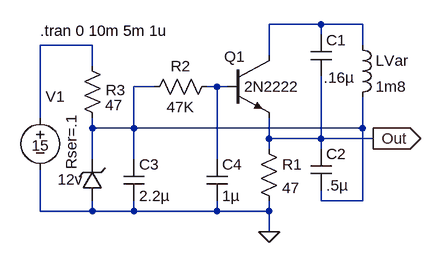
[diagram p0: schematic Colpitts.asc]
Colpitts.asc, the LTspice schematic file:
Version 4
SHEET 1 880 680
WIRE 144 112 64 112
WIRE 208 112 144 112
WIRE 144 128 144 112
WIRE -208 144 -288 144
WIRE 208 144 208 112
WIRE 64 160 64 112
WIRE -208 176 -208 144
WIRE -112 208 -144 208
WIRE -16 208 -32 208
WIRE 0 208 -16 208
WIRE -288 256 -288 144
WIRE -208 272 -208 256
WIRE -144 272 -144 208
WIRE -144 272 -208 272
WIRE 208 272 208 224
WIRE 208 272 -144 272
WIRE 64 288 64 256
WIRE 144 288 144 192
WIRE 144 288 64 288
WIRE 224 288 144 288
WIRE 64 304 64 288
WIRE 144 304 144 288
WIRE -208 320 -208 272
WIRE -144 320 -144 272
WIRE -16 320 -16 208
WIRE 144 384 144 368
WIRE 208 384 208 272
WIRE 208 384 144 384
WIRE -288 400 -288 336
WIRE -208 400 -208 384
WIRE -208 400 -288 400
WIRE -144 400 -144 384
WIRE -144 400 -208 400
WIRE -16 400 -16 384
WIRE -16 400 -144 400
WIRE 64 400 64 384
WIRE 64 400 -16 400
WIRE 64 432 64 400
FLAG 64 432 0
FLAG 224 288 Out
IOPIN 224 288 Out
SYMBOL npn2 0 160 R0
WINDOW 0 -5 2 Left 0
WINDOW 3 26 48 Left 0
SYMATTR InstName Q1
SYMATTR Value 2N2222
SYMBOL ind 192 128 R0
SYMATTR InstName LVar
SYMATTR Value 1m8
SYMBOL cap 128 128 R0
WINDOW 3 20 66 Left 0
SYMATTR Value .16µ
SYMATTR InstName C1
SYMBOL cap 128 304 R0
SYMATTR InstName C2
SYMATTR Value .5µ
SYMBOL res 48 288 R0
SYMATTR InstName R1
SYMATTR Value 47
SYMATTR SpiceLine tol=1 pwr=0.1
SYMBOL voltage -288 240 R0
WINDOW 0 8 -17 Left 0
WINDOW 3 -13 59 Left 0
WINDOW 123 0 0 Left 0
WINDOW 39 48 10 VRight 0
SYMATTR InstName V1
SYMATTR Value 15
SYMATTR SpiceLine Rser=.1
SYMBOL zener -192 384 R180
WINDOW 0 30 33 Left 0
WINDOW 3 24 0 Invisible 0
SYMATTR InstName 12v
SYMATTR Value BZX84C12L
SYMBOL res -224 160 R0
WINDOW 0 37 53 Left 0
SYMATTR InstName R3
SYMATTR Value 47
SYMATTR SpiceLine tol=1 pwr=0.1
SYMBOL res -16 192 R90
WINDOW 0 0 56 VBottom 0
WINDOW 3 32 56 VTop 0
SYMATTR InstName R2
SYMATTR Value 47K
SYMATTR SpiceLine tol=1 pwr=0.1
SYMBOL cap -160 320 R0
SYMATTR InstName C3
SYMATTR Value 2.2µ
SYMATTR SpiceLine V=10 Irms=0 Rser=0.002 MTBF=0 Lser=0 mfg="TDK" pn="C2012X5RIA225K" type="X5R" ppPkg=1
SYMBOL cap -32 320 R0
SYMATTR InstName C4
SYMATTR Value 1µ
SYMATTR SpiceLine V=10 Irms=10.541 Rser=0.004 MTBF=0 Lser=1.25p mfg="KEMET" pn="C0603C105K8PAC" type="X5R" ppPkg=1
TEXT -288 122 Left 0 !.tran 0 10m 5m 1u

The netlist it stands for:
* Colpitts.asc
Q1 N001 N004 Out 0 2N2222
LVar N001 N003 1m8
C1 N001 Out .16µ
C2 Out N003 .5µ
R1 Out 0 47 tol=1 pwr=0.1
V1 N002 0 15 Rser=.1
D§12v 0 N003 BZX84C12L
R3 N002 N003 47 tol=1 pwr=0.1
R2 N004 N003 47K tol=1 pwr=0.1
C3 N003 0 2.2µ V=10 Irms=0 Rser=0.002 MTBF=0 Lser=0 mfg="TDK" pn="C2012X5RIA225K" type="X5R" ppPkg=1
C4 N004 0 1µ V=10 Irms=10.541 Rser=0.004 MTBF=0 Lser=1.25p mfg="KEMET" pn="C0603C105K8PAC" type="X5R" ppPkg=1
.model D D
.lib standard.dio
.model NPN NPN
.model PNP PNP
.lib standard.bjt
.tran 0 10m 5m 1u
.backanno
.end